# EAGLE design cc2652r_v2.1_rs (EAGLE 9.6.2)
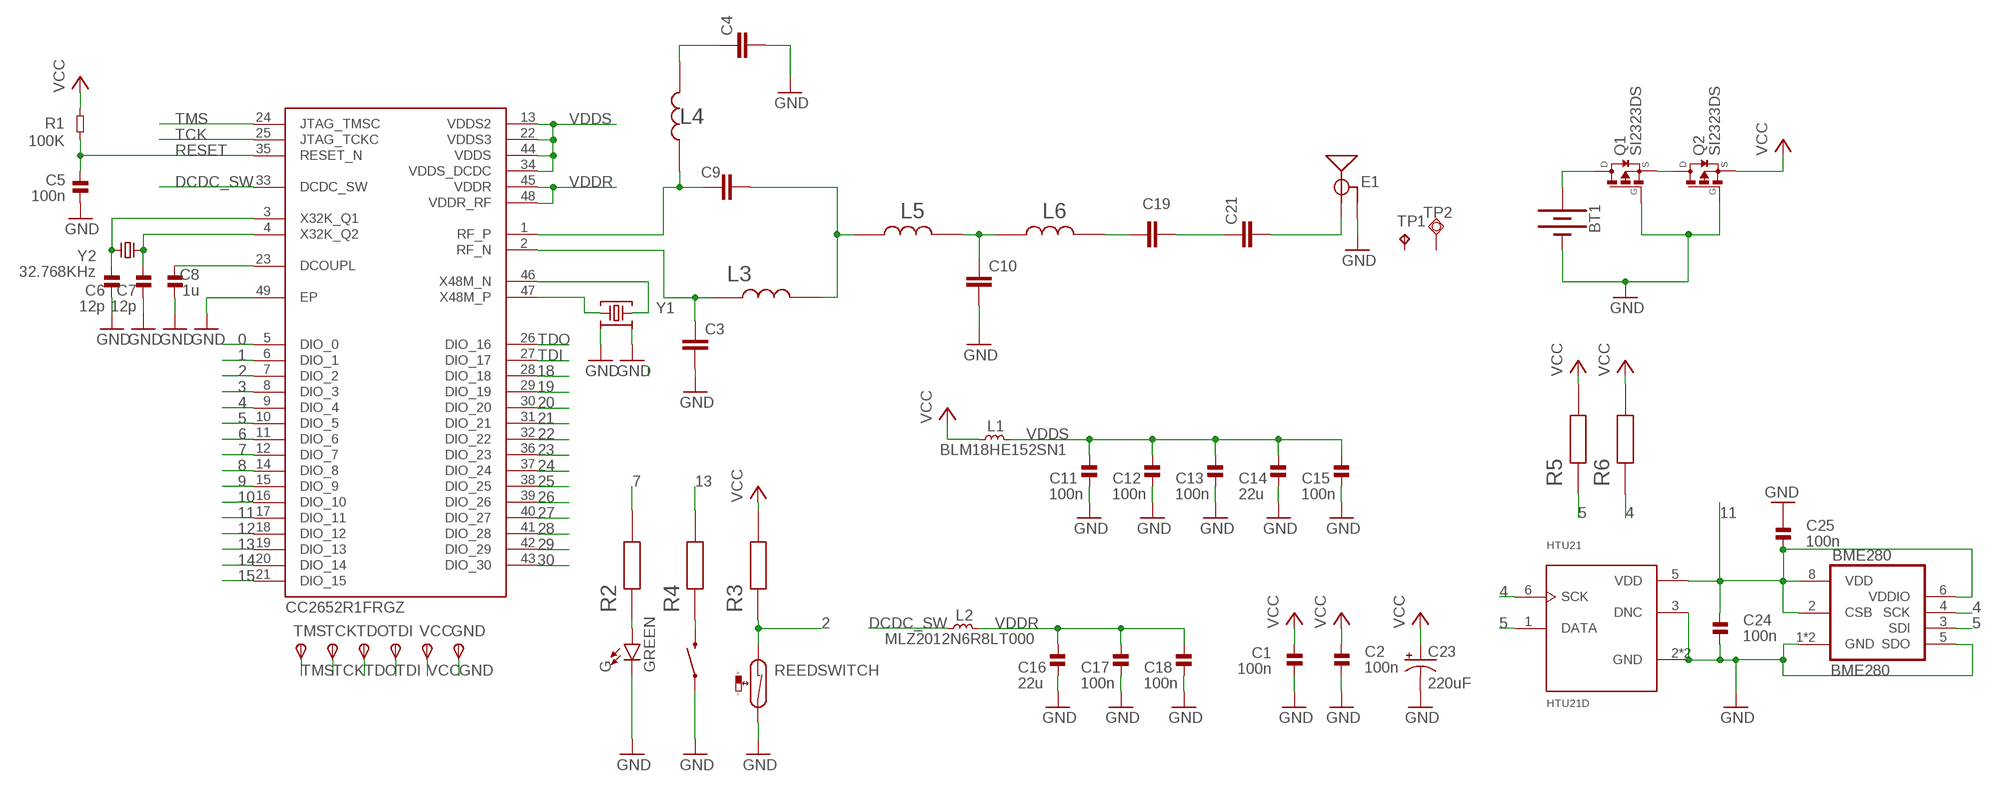
[diagram p0: schematic, sheet 1]

## Parts
BME280  BME280  [BME280]
BT1  BATTERY-20MM_SMD  [BATTCON_20MM]
C1  100n  CAP-0402  [_PKG_C_0402]
C2  100n  CAP-0402  [_PKG_C_0402]
C3  1pf  CAP0402  [CAPC1005X40N]
C4  12pF  CAP0402  [CAPC1005X40N]
C5  100n  CAP-0402  [_PKG_C_0402]
C6  12p  CAP-0402  [_PKG_C_0402]
C7  12p  CAP-0402  [_PKG_C_0402]
C8  1u  CAP-0402  [_PKG_C_0402]
C9  1pF  CAP0402  [CAPC1005X40N]
C10  1pF  CAP0402  [CAPC1005X40N]
C11  100n  CAP-0402  [_PKG_C_0402]
C12  100n  CAP-0402  [_PKG_C_0402]
C13  100n  CAP-0402  [_PKG_C_0402]
C14  22u  CAP-0805  [_PKG_C_0805]
C15  100n  CAP-0402  [_PKG_C_0402]
C16  22u  CAP-0805  [_PKG_C_0805]
C17  100n  CAP-0402  [_PKG_C_0402]
C18  100n  CAP-0402  [_PKG_C_0402]
C19  12pF  CAP0402  [CAPC1005X40N]
C21  1.8pF  CAP0402  [CAPC1005X40N]
C23  220uF  68UF-POLAR-EIA3528-10V-10%(TANT)  [EIA3528]
C24  100n  CAP-0402  [_PKG_C_0402]
C25  100n  CAP-0402  [_PKG_C_0402]
E1  ANTENNA-GROUNDEDTRACE-15.2MM  [TRACE_ANTENNA_2.4GHZ_15.2MM]
G  GREEN  LED-GREEN0603  [LED-0603]
GND  TPSTP11R  [TP11R]
HTU21  HTU21D  [QFN100P300X300X100-7N]
IC3  CC2652R1FRGZ  CC2652R1FRGZT  [QFN50P700X700X100-49N]
L1  BLM18HE152SN1  INDUCTOR-0603  [_PKG_L_0603]
L2  MLZ2012N6R8LT000  INDUCTOR-0805  [_PKG_C_0805]
L3  2.4nH  IND0402IND0402  [INDC1005X40N]
L4  2.4nH  IND0402IND0402  [INDC1005X40N]
L5  2nH  IND0402IND0402  [INDC1005X40N]
L6  2nH  IND0402IND0402  [INDC1005X40N]
Q1  SI2323DS  [SOT23]
Q2  SI2323DS  [SOT23]
R1  100K  RES-0402  [_PKG_C_0402]
R2  2.2k  RES0402  [RESC1005X40N]
R3  510k  RES0402  [RESC1005X40N]
R4  100Ohm  RES0402  [RESC1005X40N]
R5  10k  RES0402  [RESC1005X40N]
R6  10k  RES0402  [RESC1005X40N]
REEDSWITCH  REED-SWITCH-MK6-5-B  [MK6-5]
SW1  MOMENTARY-SWITCH-SPST-SMD-4.6X2.8MM  [TACTILE_SWITCH_SMD_4.6X2.8MM]
TCK  TPSTP11R  [TP11R]
TDI  TPSTP11R  [TP11R]
TDO  TPSTP11R  [TP11R]
TMS  TPSTP11R  [TP11R]
TP1  TPTP06SQ  [TP05SQ]
TP2  TPSQTP15SQ  [TP15SQ]
VCC  TPSTP11R  [TP11R]
Y1  Q22FA12800150  48.000MHZ_CX2016DB48000C0FPLC1  [XTAL-4P-2016]
Y2  32.768KHz  32.768KHZ_Q13FC1350000400  [XTAL-2P-3215]

## Nets
0: IC3.5(DIO_0)
1: IC3.6(DIO_1)
2: IC3.7(DIO_2) R3.1 REEDSWITCH.1
3: IC3.8(DIO_3)
4: BME280.4(SCK) HTU21.6(SCK) IC3.9(DIO_4) R6.1
5: BME280.3(SDI) HTU21.1(DATA) IC3.10(DIO_5) R5.1
6: IC3.11(DIO_6)
7: IC3.12(DIO_7) R2.2
8: IC3.14(DIO_8)
9: IC3.15(DIO_9)
10: IC3.16(DIO_10)
11: BME280.2(CSB) BME280.6(VDDIO) BME280.8(VDD) C24.2 C25.1 HTU21.5(VDD) IC3.17(DIO_11)
12: IC3.18(DIO_12)
13: IC3.19(DIO_13) R4.2
14: IC3.20(DIO_14)
15: IC3.21(DIO_15)
18: IC3.28(DIO_18)
19: IC3.29(DIO_19)
20: IC3.30(DIO_20)
21: IC3.31(DIO_21)
22: IC3.32(DIO_22)
23: IC3.36(DIO_23)
24: IC3.37(DIO_24)
25: IC3.38(DIO_25)
26: IC3.39(DIO_26)
27: IC3.40(DIO_27)
28: IC3.41(DIO_28)
29: IC3.42(DIO_29)
30: IC3.43(DIO_30)
DCDC_SW: IC3.33(DCDC_SW) L2.1
DCOUPL: C8.2 IC3.23(DCOUPL)
GND: BME280.1(GND) BME280.5(SDO) BME280.7(GND) BT1.2(-) C1.1 C2.1 C3.2 C4.2 C5.1 C6.1 C7.1 C8.1 C10.2 C11.2 C12.2 C13.2 C14.2 C15.2 C16.2 C17.2 C18.2 C23.C(-) C24.1 C25.2 E1.GND G.C GND.TP(PP) HTU21.2(GND) HTU21.3(DNC) HTU21.PAD(GND) IC3.49(EP) Q1.1(G) Q2.1(G) REEDSWITCH.2 SW1.1 SW1.2 Y1.2 Y1.4
N$1: C9.1 IC3.1(RF_P) L4.1
N$2: C3.1 IC3.2(RF_N) L3.1
N$3: C4.1 L4.2
N$4: C9.2 L3.2 L5.1
N$5: C19.1 L6.2
N$6: R4.1 SW1.3 SW1.4
N$7: C19.2 C21.1
N$8: BT1.1(+) Q1.3(D)
N$9: C21.2 E1.ANT(SIGNAL)
N$10: C10.1 L5.2 L6.1
N$11: G.A R2.1
N$15: Q1.2(S) Q2.3(D)
RESET: C5.2 IC3.35(RESET_N) R1.1
TCK: IC3.25(JTAG_TCKC) TCK.TP(PP)
TDI: IC3.27(DIO_17) TDI.TP(PP)
TDO: IC3.26(DIO_16) TDO.TP(PP)
TMS: IC3.24(JTAG_TMSC) TMS.TP(PP)
VCC: C1.2 C2.2 C23.A(+) L1.1 Q2.2(S) R1.2 R3.2 R5.2 R6.2 VCC.TP(PP)
VDDR: C16.1 C17.1 C18.1 IC3.45(VDDR) IC3.48(VDDR_RF) L2.2
VDDS: C11.1 C12.1 C13.1 C14.1 C15.1 IC3.13(VDDS2) IC3.22(VDDS3) IC3.34(VDDS_DCDC) IC3.44(VDDS) L1.2
X32K_Q1: C6.2 IC3.3(X32K_Q1) Y2.1
X32K_Q2: C7.2 IC3.4(X32K_Q2) Y2.2
X48M_N: IC3.46(X48M_N) Y1.3
X48M_P: IC3.47(X48M_P) Y1.1
Unconnected: TP1.TP TP2.TP

## Library data of the parts
BME280 = bosch-bme280:BME280: DIGITAL HUMIDITY, PRESSURE AND TEMPERATURE SENSOR * Digital interface I²C (up to 3.4 MHz) and SPI (3 and 4 wire, up to 10 MHz)* Supply voltage VDD main supply voltage range: 1.71 V to 3.6 V*VDDIO interface voltage range: 1.2 V to 3.6 V Operating range -40…+85 °C, 0…100 % rel. humidity, 300…1100 hPa The library has been designed by Richard Magdycz <https://www.facebook.com/groups/eaglecadsoftUK>
BT1 = Batteries:BATTERY: Battery - Single Cell A variety of battery chemistries, sizes, and footprints. Device List: 20MM_PTH - Coin Cell Battery Holder - 20mm (PTH) <https://www.sparkfun.com/products/783> 6.8MM_PTH - Coin Cell Battery Holder - 6.8MM(SMD) <https://www.digikey.com/product-detail/en/seiko-instruments/MS621FE-FL11E/728-1057-ND/1889208?WT.srch=1&gclid=CNOQ5a6LzdQCFZS2wAodXCkE0g> 12MM_SMD - Coin Cell Battery Holder - 12mm (SMD) <https://www.sparkfun.com/products/10592> 12MM_PTH - Coin Cell Battery Holder - 12mm (PTH) <https://www.sparkfun.com/products/7948> 20MM_SMD - 20mm Coin Cell Battery Holder (SMD) (2 legs) Used on the Big Time Watch Kit <https://www.sparkfun.com/products/11734> 20MM_SMD_4LEGS - Coin Cell Battery Holder - 20mm (SMD) <https://www.sparkfun.com/products/11892> 20MM_SMD_4LEGS_OVERPASTE - Coin Cell Battery Holder - 20mm (SMD) <https://www.sparkfun.com/products/11892> (Over-paste on the legs) 24.5MM_PTH - Coin Cell Battery Holder - 24.5mm (PTH) <https://www.sparkfun.com/products/8863> 9V - 9V Battery Holder - PC Mount Used on the SparkFun SparkPunk Sound Kit <https://www.sparkfun.com/products/11177> and SparkFun SparkPunk Sequencer Kit <https://www.sparkfun.com/products/12707> 18650 - Battery Holder - 18650 (PTH) <https://www.sparkfun.com/products/13113> AA - Battery Holder - 1xAA (PTH) <https://www.sparkfun.com/products/7949> AAA - Battery Holder - 1xAAA (PTH) <https://www.sparkfun.com/products/12718> AA_KIT - Battery Holder - 1xAA (PTH) <https://www.sparkfun.com/products/7949> Special kit package - pads only have exposed copper on one side of the board. AAA_KIT - Battery Holder - 1xAAA (PTH) <https://www.sparkfun.com/products/12718> Special kit package - pads only have exposed copper on one side of the board.; PROD_ID: BATT-11519
C1 C2 C5-C8 C11-C18 C24 C25 = ok-discretes-dev:CAP
C3 C4 C9 C10 C19 C21 = discretes-dev:CAP0402: CAP, 0402; AVAILABILITY: Good; DESCRIPTION: RESISTOR, 0402 0.063W 1% 3M6; Resistance:3.6Mohm; Resistance Tolerance:± 1%; Power Rating:0.063W; Voltage Rating:50V; Series:RC32H; Temperature Coefficient:± 100ppm/°C; Resistor Element Type:Thick Film; Resistor Case Style:0402; No. of Pins:2; SVHC:No SVHC; Case Style:0402; External Length / Height:1mm; Temperature Coeff. +:100ppm/°C; Temperature Coeff. -:100ppm/°C; External Depth:0.35mm; External Width:0.5mm; Operating Temperature Range:-55°C to +155°C; Overload Voltage:100V; MF: Yageo; MP: RC0402FR-073M6L; PACKAGE: 1005 Panasonic Electronic Components; PRICE: None; PURCHASE-URL: https://pricing.snapeda.com/search/part/RC0402FR-073M6L/?ref=eda
C23 = SparkFun-Capacitors:68UF-POLAR: 68µF polarized capacitors A capacitor is a passive two-terminal electrical component used to store electrical energy temporarily in an electric field.; PROD_ID: CAP-10790; VALUE: 68uF
E1 = SparkFun-RF2:ANTENNA-GROUNDED: Antenna w/ Ground Connection 2.4GHz antennae with signal and ground terminals. TRACE_ANTENNA_2.4GHZ_15.2MM - Meander Trace antenna 15.2 x 5.7mm footprint Based on layout from TI app note AN043 <http://www.ti.com/lit/an/swra117d/swra117d.pdf>. TRACE_ANTENNA_2.4GHZ_25.7MM - Inverted F trace antenna 25.7 x 7.5 mm footprint. Based on layout from TI design note DN0007 <http://www.ti.com/lit/an/swru120b/swru120b.pdf>.
G = SparkFun-LED:LED-GREEN: Green SMD LED Used in manufacturing of various products at SparkFun Packages: 0603 - SMD 0603 package [Product Link] <http://www.futureelectronics.com/en/technologies/semiconductors/optoelectronics/leds/Pages/9894312-LTST-C190GKT.aspx?CrossPart=HSMG-C190&IM=0> LilyPad 1206 - SMD1206 LilyPad package [Product Link] <http://www.futureelectronics.com/en/Technologies/Product.aspx?ProductID=IN150NGHARVATEKCORPORATION2049943&IM=0> 1206 - SMD1206 package [Product Link] <http://www.futureelectronics.com/en/technologies/semiconductors/optoelectronics/leds/Pages/8315665-LTST-C150KGKT.aspx?IM=0> 1206 Bottom Mount -SMD 1206 Bottom Mount [Product Link] <http://www.digikey.com/product-detail/en/lite-on-inc/LTST-C230KGKT/160-1456-1-ND/386854> SparkFun Products: Pro Mini 328 -5V <https://www.sparkfun.com/products/821> RedBoard <https://www.sparkfun.com/products/12757> MP3 Trigger <https://www.sparkfun.com/products/13720> Makey Makey <https://www.sparkfun.com/products/11076>; PROD_ID: DIO-00821
GND TCK TDI TDO TMS VCC = testpad:TPS: TEST PIN
HTU21 = HTU21D:HTU21D: Digital Relative Humidity sensor with Temperature output Check prices <https://pricing.snapeda.com/parts/HTU21D/TE%20Connectivity/view-part?ref=eda>; AVAILABILITY: Warning; COMMENT: CAT-HSC0004; DESCRIPTION: Humidity Temperature Sensor 0 ~ 100% RH I²C ±2% RH 5s Surface Mount; MF: TE Connectivity; MP: HTU21D; PACKAGE: DFN-6 TE Connectivity; PRICE: None; PURCHASE-URL: https://pricing.snapeda.com/search/part/HTU21D/?ref=eda
IC3 = CC2652R1FRGZT:CC2652R1FRGZT: Texas Instruments SimpleLink? Multi-Standard CC2652R Wireless MCU 48-VQFN -40 to 85 Source: Datasheet <http://www.ti.com/lit/ds/symlink/cc2652r.pdf>; ARROW_PART_NUMBER: CC2652R1FRGZT; ARROW_PRICE-STOCK: https://www.arrow.com/en/products/cc2652r1frgzt/texas-instruments; DESCRIPTION: Texas Instruments SimpleLink? Multi-Standard CC2652R Wireless MCU 48-VQFN -40 to 85; HEIGHT: 1mm; MANUFACTURER_NAME: Texas Instruments; MANUFACTURER_PART_NUMBER: CC2652R1FRGZT; MOUSER_PART_NUMBER: 595-CC2652R1FRGZT; MOUSER_PRICE-STOCK: https://www.mouser.co.uk/ProductDetail/Texas-Instruments/CC2652R1FRGZT?qs=rrS6PyfT74ekj88w7n1zLw%3D%3D
L1 L2 = ok-discretes-dev:INDUCTOR
L3-L6 = discretes-dev:IND0402: RESISTOR, 0402 0.063W 1% 3M6; Resistance:3.6Mohm; Resistance Tolerance:± 1%; Power Rating:0.063W; Voltage Rating:50V; Series:RC32H; Temperature Coefficient:± 100ppm/°C; Resistor Element Type:Thick Film; Resistor Case Style:0402; No. of Pins:2; SVHC:No SVHC; Case Style:0402; External Length / Height:1mm; Temperature Coeff. +:100ppm/°C; Temperature Coeff. -:100ppm/°C; External Depth:0.35mm; External Width:0.5mm; Operating Temperature Range:-55°C to +155°C; Overload Voltage:100V Check prices <https://pricing.snapeda.com/parts/RC0402FR-073M6L/Yageo/view-part?ref=eda>; AVAILABILITY: Good; DESCRIPTION: RESISTOR, 0402 0.063W 1% 3M6; Resistance:3.6Mohm; Resistance Tolerance:± 1%; Power Rating:0.063W; Voltage Rating:50V; Series:RC32H; Temperature Coefficient:± 100ppm/°C; Resistor Element Type:Thick Film; Resistor Case Style:0402; No. of Pins:2; SVHC:No SVHC; Case Style:0402; External Length / Height:1mm; Temperature Coeff. +:100ppm/°C; Temperature Coeff. -:100ppm/°C; External Depth:0.35mm; External Width:0.5mm; Operating Temperature Range:-55°C to +155°C; Overload Voltage:100V; MF: Yageo; MP: RC0402FR-073M6L; PACKAGE: 1005 Panasonic Electronic Components; PRICE: None; PURCHASE-URL: https://pricing.snapeda.com/search/part/RC0402FR-073M6L/?ref=eda
Q1 Q2 = SI2323DS:SI2323DS: P-Channel MOSFET; AVAILABILITY: Unavailable; DESCRIPTION: P-Channel 20V 3.7A (Ta) 750mW (Ta) Surface Mount SOT-23-3 (TO-236); MF: Vishay Siliconix; MP: SI2323DS; PACKAGE: SOT-23-3 Vishay Siliconix; PRICE: None
R1 = ok-discretes-dev:RES
R2-R6 = discretes-dev:RES0402: RESISTOR, 0402 0.063W 1% 3M6; Resistance:3.6Mohm; Resistance Tolerance:± 1%; Power Rating:0.063W; Voltage Rating:50V; Series:RC32H; Temperature Coefficient:± 100ppm/°C; Resistor Element Type:Thick Film; Resistor Case Style:0402; No. of Pins:2; SVHC:No SVHC; Case Style:0402; External Length / Height:1mm; Temperature Coeff. +:100ppm/°C; Temperature Coeff. -:100ppm/°C; External Depth:0.35mm; External Width:0.5mm; Operating Temperature Range:-55°C to +155°C; Overload Voltage:100V Check prices <https://pricing.snapeda.com/parts/RC0402FR-073M6L/Yageo/view-part?ref=eda>; AVAILABILITY: Good; DESCRIPTION: RESISTOR, 0402 0.063W 1% 3M6; Resistance:3.6Mohm; Resistance Tolerance:± 1%; Power Rating:0.063W; Voltage Rating:50V; Series:RC32H; Temperature Coefficient:± 100ppm/°C; Resistor Element Type:Thick Film; Resistor Case Style:0402; No. of Pins:2; SVHC:No SVHC; Case Style:0402; External Length / Height:1mm; Temperature Coeff. +:100ppm/°C; Temperature Coeff. -:100ppm/°C; External Depth:0.35mm; External Width:0.5mm; Operating Temperature Range:-55°C to +155°C; Overload Voltage:100V; MF: Yageo; MP: RC0402FR-073M6L; PACKAGE: 1005 Panasonic Electronic Components; PRICE: None; PURCHASE-URL: https://pricing.snapeda.com/search/part/RC0402FR-073M6L/?ref=eda
REEDSWITCH = switch-reed:REED-SWITCH-: Reed Sensor; MF: MEDER; MPN: MK6-5-B; OC_FARNELL: 1079479
SW1 = SparkFun-Switches:MOMENTARY-SWITCH-SPST: Momentary Switch (Pushbutton) - SPST Normally-open (NO) SPST momentary switches (buttons, pushbuttons). Variants PTH-12MM - 12mm square, through-hole Momentary Pushbutton Switch - 12mm Square <https://www.sparkfun.com/products/9190> (COM-09190) PTH-6.0MM, PTH-6.0MM-KIT - 6.0mm square, through-hole Mini Pushbutton Switch <https://www.sparkfun.com/products/97> (COM-00097) KIT package intended for soldering kit's - only one side of pads' copper is exposed. PTH-RIGHT-ANGLE-KIT - Right-angle, through-hole Right Angle Tactile Button <https://www.sparkfun.com/products/10791> - Used on SparkFun BigTime Watch Kit <https://www.sparkfun.com/products/11734> SMD-12MM - 12mm square, surface-mount Tactile Button - SMD (12mm) <https://www.sparkfun.com/products/12993> (COM-12993) Used on SparkFun PicoBoard <https://www.sparkfun.com/products/11888> SMD-4.5MM - 4.5mm Square Trackball Switch Used on SparkFun Blackberry Trackballer Breakout <https://www.sparkfun.com/products/13169> SMD-4.6MMX2.8MM - 4.60mm x 2.80mm, surface mount Used on SparkFun SAMD21 Mini Breakout <https://www.sparkfun.com/products/13664> SMD-5.2MM, SMD-5.2-REDUNDANT - 5.2mm square, surface-mount Mini Pushbutton Switch - SMD <https://www.sparkfun.com/products/8720> (COM-08720) Used on Arduino Pro Mini <https://www.sparkfun.com/products/11114> REDUNDANT package connects both switch circuits together SMD-6.0X3.5MM - 6.0 x 3.5mm, surface mount Momentary Reset Switch SMD <https://www.sparkfun.com/products/8229> (COM-08229) SMD-6.2MM-TALL - 6.2mm square, surface mount Tactile Button - SMD (6mm) <https://www.sparkfun.com/products/12992> Used on SparkFun Digital Sandbox <https://www.sparkfun.com/products/12651> SMD-RIGHT-ANGLE - Right-angle, surface mount Used on SparkFun Block for Intel® Edison - Arduino <https://www.sparkfun.com/products/13036>; PROD_ID: SWCH-13065
TP1 = testpad:TP: Test pad
TP2 = testpad:TPSQ: Test pad
Y1 = ok-xtal-osc-dev:48.000MHZ_CX2016DB48000C0FPLC1: 48MHz ±10ppm Crystal 7pF 50 Ohms 4-SMD, No Lead Datasheet <https://media.digikey.com/pdf/Data%20Sheets/Kyocera%20International/CX2016DB48000C0FPLC1_DS.pdf>; DIGIKEY_PART: 1253-2042-1-ND; MFG_NAME: KYOCERA; MFG_PART: CX2016DB48000C0FPLC1
Y2 = ok-xtal-osc-dev:32.768KHZ_Q13FC1350000400: SMD Crystal Resonators 32.768KHz +/-20ppm SMD-3215_2P RoHS Datasheet <https://datasheet.lcsc.com/szlcsc/1901081604_Seiko-Epson-Q13FC1350000400_C32346.pdf>; LCSC_PART: C32346; MFG_NAME: SEIKO EPSON; MFG_PART: Q13FC1350000400

## Board
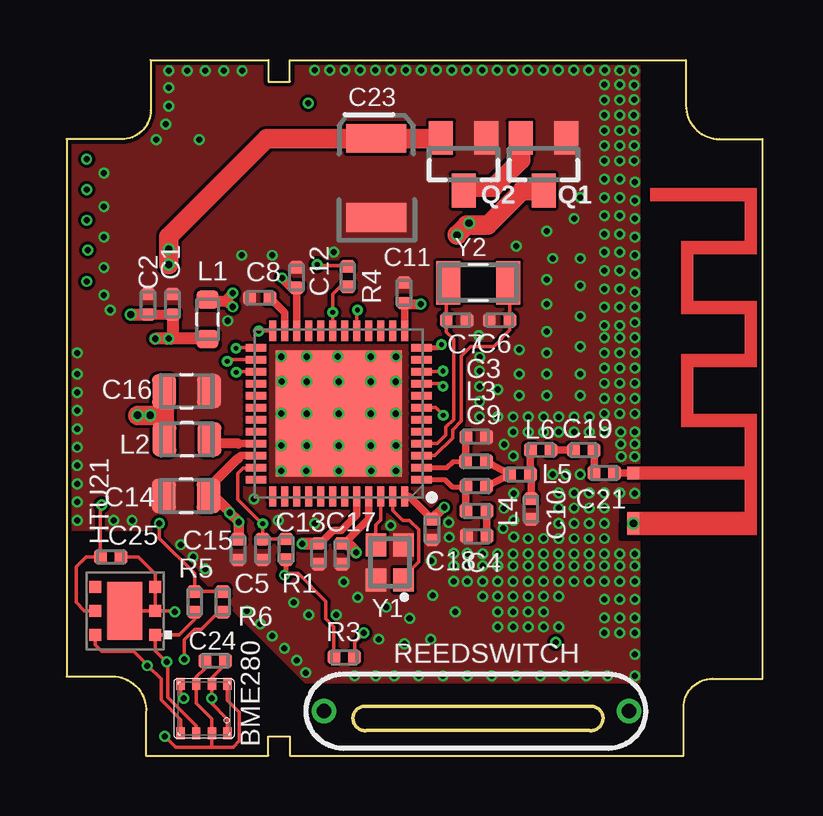
[diagram p1: board, top side]
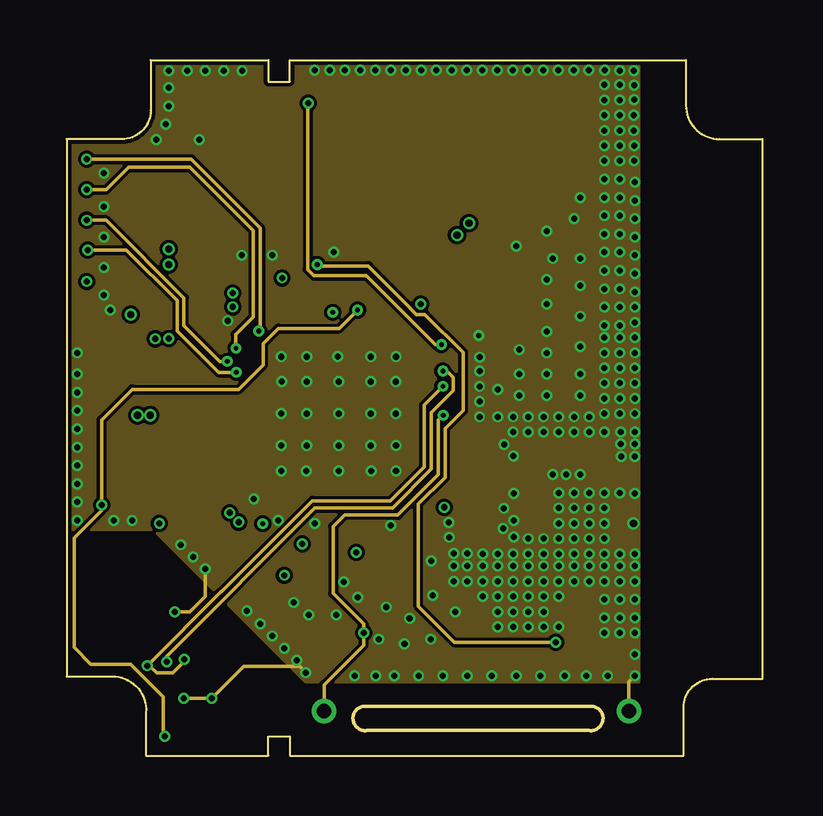
[diagram p2: board, inner layer Route2]
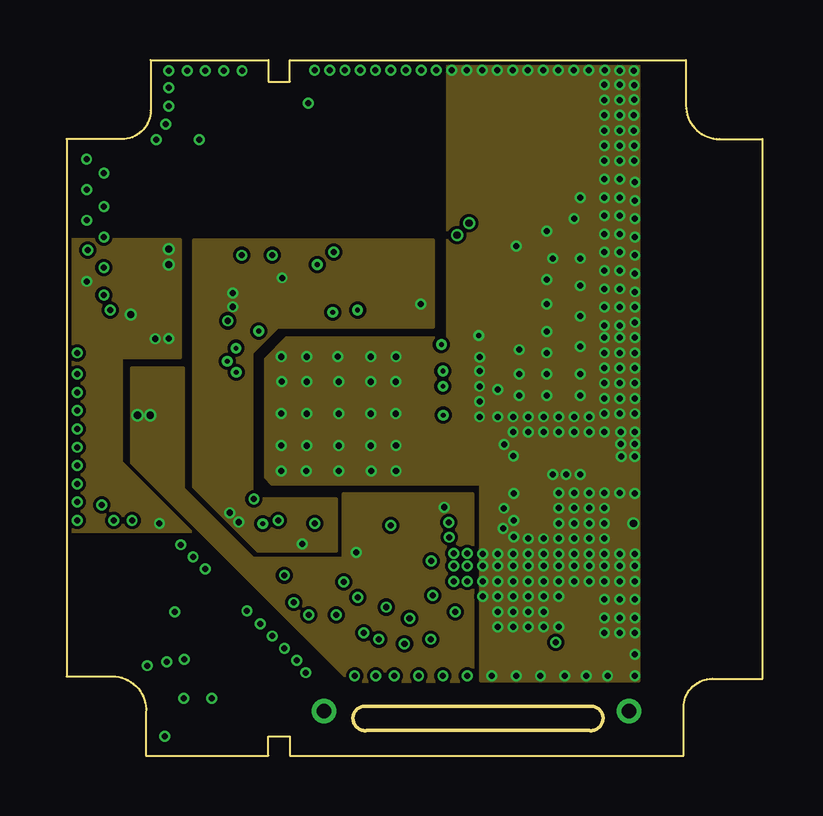
[diagram p3: board, inner layer Route15]
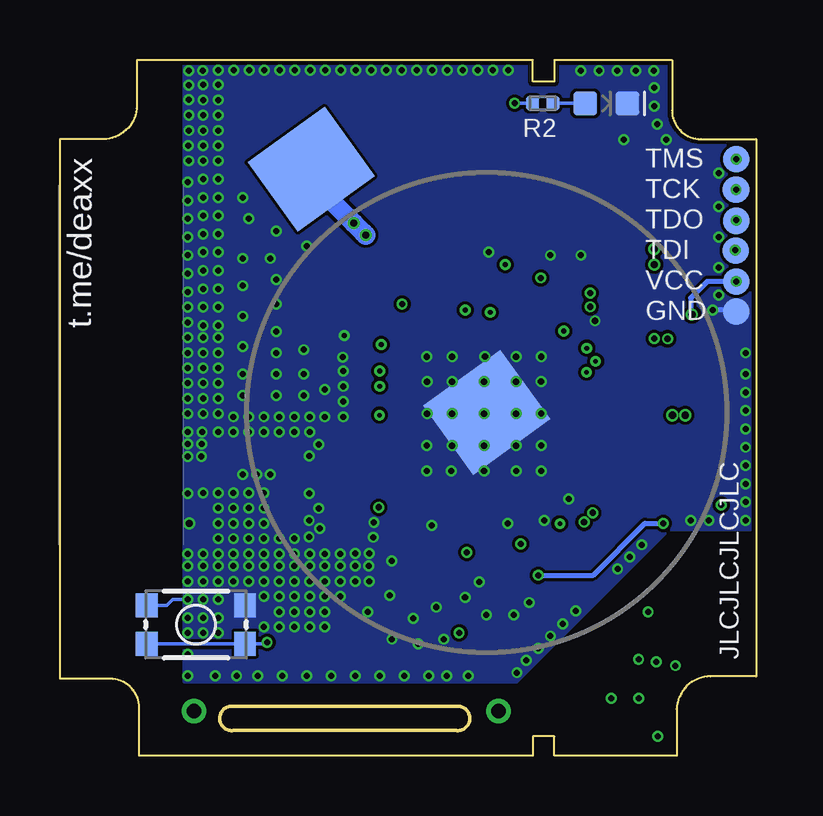
[diagram p4: board, bottom side, seen from below]

Size 29 x 29 mm. Coordinates in mm from the lower left corner, seen from the top.
Outline: 12.37,2.06 21.9,2.06 arc-180 21.77,1.04 12.5,1.04 arc-180 12.37,2.06
Outline: 29,3.2 29,25.7 27.2,25.7 arc-90 25.8,27.1 25.8,29 9.3,29 9.3,28.1 8.4,28.1 8.4,29 3.5,29 3.5,26.9 arc-90 2.3,25.7 0,25.7 0,3.3 1.9,3.3 arc-94 3.3,1.8 3.3,0 8.4,0 8.4,0.8 9.3,0.8 9.3,0 25.7,0 25.7,2 arc-90 26.9,3.2 29,3.2
Copper layers (1*2*15*16): Top 0.035559375mm / dielectric 0.17018125mm / Route2 0.01778125mm / dielectric 0.4mm / Route15 0.01778125mm / dielectric 0.17018125mm / Bottom 0.035559375mm
Design rules "oshpark-4layer *": minimum track width 6mil, minimum drill 0.2mm, track to track 5mil, track to pad 5mil, pad to pad 5mil, via to via 5mil, smd to smd 5mil, copper to edge 0.16mm, drill to drill 0.2mm, minimum pad ring 4mil, minimum via ring 4mil, stop-mask expansion 2.5mil, vias tented up to drill 50mil, thermal gap 10mil
tRestrict: area 16.4,18.8 to 17.9,20.6; 3 lines

### Footprints (pad centres in the part's own frame; a part is rotated, then mirrored left to right if it is on the bottom)
BME280 = smd 0.35 x 0.5: 1 0.975,-1.025; 2 0.325,-1.025; 3 -0.325,-1.025; 4 -0.975,-1.025; 5 -0.975,1.025; 6 -0.325,1.025; 7 0.325,1.025; 8 0.975,1.025
BATTCON_20MM = smd 3.56 x 3.96: 1 -12.5,0; 2 0,0
_PKG_C_0402 = smd 0.54 x 0.6: 1 -0.43,0; 2 0.43,0
CAPC1005X40N = smd 0.54 x 0.6: 1 -0.432,0; 2 0.432,0
_PKG_C_0805 = smd 1 x 1.42: 1 -0.935,0; 2 0.935,0
EIA3528 = smd 1.2 x 2.5: A 1.65,0; C -1.65,0
TRACE_ANTENNA_2.4GHZ_15.2MM = smd 0.5 x 0.5: ANT -3.127,-0.25 | smd 0.9 x 0.5: GND -1.027,-0.25
LED-0603 = smd 1 x 1: A -0.877,0; C 0.877,0
TP11R = smd 1.1 x 1.1: TP 0,0
QFN100P300X300X100-7N = smd 0.5 x 0.5: 1 -1.25,1; 2 -1.25,0; 3 -1.25,-1; 4 1.25,-1; 5 1.25,0; 6 1.25,1 | smd 1.45 x 2.4: PAD 0.013,0.002
QFN50P700X700X100-49N = smd 0.85 x 0.3: 1 -3.45,2.75; 2 -3.45,2.25; 3 -3.45,1.75; 4 -3.45,1.25; 5 -3.45,0.75; 6 -3.45,0.25; 7 -3.45,-0.25; 8 -3.45,-0.75; 9 -3.45,-1.25; 10 -3.45,-1.75; 11 -3.45,-2.25; 12 -3.45,-2.75; 25 3.45,-2.75; 26 3.45,-2.25; 27 3.45,-1.75; 28 3.45,-1.25; 29 3.45,-0.75; 30 3.45,-0.25; 31 3.45,0.25; 32 3.45,0.75; 33 3.45,1.25; 34 3.45,1.75; 35 3.45,2.25; 36 3.45,2.75 | smd 0.3 x 0.85: 13 -2.75,-3.45; 14 -2.25,-3.45; 15 -1.75,-3.45; 16 -1.25,-3.45; 17 -0.75,-3.45; 18 -0.25,-3.45; 19 0.25,-3.45; 20 0.75,-3.45; 21 1.25,-3.45; 22 1.75,-3.45; 23 2.25,-3.45; 24 2.75,-3.45; 37 2.75,3.45; 38 2.25,3.45; 39 1.75,3.45; 40 1.25,3.45; 41 0.75,3.45; 42 0.25,3.45; 43 -0.25,3.45; 44 -0.75,3.45; 45 -1.25,3.45; 46 -1.75,3.45; 47 -2.25,3.45; 48 -2.75,3.45 | smd 5.25 x 5.25: 49 0,0
_PKG_L_0603 = smd 0.79 x 0.93: 1 -0.82,0; 2 0.82,0
INDC1005X40N = smd 0.54 x 0.6: 1 -0.432,0; 2 0.432,0
SOT23 = smd 1 x 1.4: 1 -0.95,-1.1; 2 0.95,-1.1; 3 0,1.1
RESC1005X40N = smd 0.54 x 0.6: 1 -0.432,0; 2 0.432,0
MK6-5 = drill 0.6 pad 1.016: 1 -6.35,0; 2 6.35,0
TACTILE_SWITCH_SMD_4.6X2.8MM = smd 0.9 x 1: 1 -2.05,-0.8; 2 2.05,-0.8; 3 2.05,0.8; 4 -2.05,0.8
TP05SQ = smd 0.5 x 0.5: TP 0,0
TP15SQ = smd 0.5 x 0.9: TP 0,0
XTAL-4P-2016 = smd 0.95 x 0.85: 1 -0.725,-0.575; 2 0.725,-0.575; 3 0.725,0.575; 4 -0.725,0.575
XTAL-2P-3215 = smd 1 x 1.8: 1 -1.25,0; 2 1.25,0

### Placement (x,y rotation side)
BME280  5.72,1.96 0 top
BT1  11.22,14.31 305.8 bottom
C1  4.41,18.81 270 top
C2  3.38,18.81 270 top
C3  17.06,13.29 0 top
C4  17.08,9.15 180 top
C5  8.16,8.59 90 top
C6  18.04,18.15 0 top
C7  16.25,18.15 180 top
C8  8.04,19.08 0 top
C9  17.06,11.23 0 top
C10  19.35,10.28 270 top
C11  14.05,19.29 90 top
C12  9.58,19.93 90 top
C13  10.49,8.41 270 top
C14  4.98,10.82 180 top
C15  7.14,8.59 270 top
C16  4.99,15.19 0 top
C17  11.46,8.41 270 top
C18  15.22,9.43 270 top
C19  21.54,12.73 359.8 top
C21  22.4,11.77 359.8 top
C23  12.9,24.08 90 top
C24  6.19,3.95 180 top
C25  1.83,8.28 0 top
E1  23.85,8.65 270 top
G  6.24,27.19 0 bottom
GND  0.82,18.5 0 bottom
HTU21  2.44,6.03 180 top
IC3  11.33,14.25 180 top
L1  5.87,18.19 90 top
L2  5.01,13.18 180 top
L3  17.05,12.26 0 top
L4  17.07,10.19 0 top
L5  18.89,11.71 0 top
L6  19.75,12.73 359.4 top
Q1  19.87,24.65 180 top
Q2  16.54,24.65 180 top
R1  9.13,8.6 270 top
R2  8.89,27.2 180 bottom
R3  11.56,4.1 180 top
R4  11.71,19.97 270 top
R5  5.32,6.4 90 top
R6  6.49,6.4 90 top
REEDSWITCH  17.07,1.85 0 top
SW1  23.34,5.46 180 bottom
TCK  0.83,23.59 0 bottom
TDI  0.84,21.05 0 bottom
TDO  0.82,22.29 0 bottom
TMS  0.82,24.86 0 bottom
TP1  23.6,11.77 0 top
TP2  23.61,9.67 0 top
VCC  0.82,19.77 0 bottom
Y1  13.46,8.05 90 top
Y2  17.15,19.71 180 top

### Tracks (layer width: path | path; a pad name or v marks a point on that pad's centre or on a via)
2  (via drill 0.2 pad 0.45, 0.25)
  Top 0.152: IC3.7 15.38,14.5 v15.69,14.19 | R3.1 11.99,4.73 v12.37,5.11
  Route2 0.152: v15.69,14.19 15.48,13.98 15.48,11.71 13.8,10.03 11.58,10.03 11.1,9.55 11.1,6.76 12.37,5.49 v12.37,5.11 12.37,4.6 10.72,2.95 REEDSWITCH.1
4  (via drill 0.2 pad 0.45, 0.25)
  Top 0.152: BME280.4 4.75,1.5 3.93,2.31 3.93,3.2 3.39,3.75 v3.36,3.75 3.36,3.78 2.8,4.35 1.45,4.35 1.19,4.6 HTU21.6 | IC3.9 15.57,15.5 v15.68,15.39 | R6.1 6.31,5.97 5.6,5.26 5.34,5.26 4.9,4.82 v4.9,4.01
  Route2 0.152: v15.68,15.39 14.9,14.61 14.9,12.04 13.48,10.62 10.24,10.62 6.46,6.84 6.44,6.84 v3.36,3.75 3.44,3.75 3.74,3.45 4.42,3.45 4.9,3.92 v4.9,4.01
5  (via drill 0.2 pad 0.45, 0.25)
  Top 0.152: BME280.3 5.4,1.24 4.21,2.43 4.21,3.85 v4.16,3.9 4.15,3.9 3.69,4.36 HTU21.1 4.68,5.03 5.32,5.68 R5.1 | IC3.10 15.65,16 v15.68,16.03
  Route2 0.152: v4.16,3.9 4.16,4.15 10.34,10.33 13.58,10.33 15.19,11.94 15.19,14.3 16.11,15.22 16.11,15.76 15.84,16.03 v15.68,16.03
7  (via drill 0.2 pad 0.45, 0.25)
  Top 0.2: IC3.12 15.48,17 v15.61,17.13
  Route2 0.152: v10.06,27.2 10.04,27.18 10.04,20.27 10.3,20.01 12.48,20.01 15.36,17.13 v15.61,17.13
  Bottom 0.152: v10.06,27.2 R2.2
11  (via drill 0.2 pad 0.45, 0.25)
  Top 0.152: 6.71,3 BME280.8 6.7,2.31 7.19,1.81 7.19,0.61 6.94,0.35 6.05,0.35 | HTU21.5 0.74,6.03 0.39,6.38 0.39,7.86 0.82,8.28 C25.1 1.4,10.44 v1.45,10.44 | C24.2 5.77,3.64 5.4,3.27 BME280.6 5.4,2.18 6.05,1.53 BME280.2 6.05,0.35 | v4.09,0.81 4.54,0.35 6.05,0.35 | IC3.17 12.08,18.53 v12.12,18.57
  Route2 0.152: v4.09,0.81 4.02,0.88 4.02,2.44 2.66,3.8 1.01,3.8 0.31,4.5 0.31,9.07 1.45,10.21 v1.45,10.44 1.45,14 2.72,15.27 7.17,15.27 8.18,16.28 8.18,17.17 8.82,17.81 11.36,17.81 v12.12,18.57
13  (via drill 0.2 pad 0.45)
  Top 0.152: IC3.19 v11.08,18.48 | v11.08,18.48 | v11.08,18.48 11.08,19.24 11.37,19.53 R4.2
24
  Top 0.152: IC3.37 8.48,10.7
DCDC_SW
  Top 0.305: IC3.33 7.17,13
  Top 0.406: 7.17,13 6.12,13 L2.1
DCOUPL
  Top 0.305: IC3.23 9.08,18.47 C8.2
GND  (via drill 0.2 pad 0.45, 0.25, 0.25 pad 0.46, 0.3)
  Top 0.152: BME280.1 6.7,1.52 6.04,2.18 v6.04,2.38 BME280.7 6.06,3 6.06,3.27 6.65,3.85 6.65,3.92 C24.1 | 2.45,6.03 HTU21.PAD HTU21.2 | v4.88,2.38 4.75,2.52 BME280.5 | HTU21.2 4.46,6.03 v4.5,6 | HTU21.2 HTU21.3 3.69,7.57 2.97,8.28 C25.2
  Top 0.2: v23.61,9.68 E1.GND
  Route2 0.152: v5.77,7.77 5.77,6.63 5.13,6 v4.5,6 | v9.96,3.46 9.7,3.71 7.37,3.71 v6.04,2.38 v4.88,2.38 | REEDSWITCH.2 23.42,3.07 v23.68,3.33
  Bottom 0.152: SW1.2 24.55,6.26 24.31,6.5 v23.68,6.5
  Bottom 0.2: GND.TP 0.88,18.57 v1.8,18.57
  other vias: 12.67,15.58 11.33,14.25 10,15.58 11.33,15.58 12.67,14.25 12.67,12.92 11.33,12.92 10,12.92 10,14.25 17.16,17.51 6.71,18.12 15.18,8.12 11.13,20.98 10,16.63 11.29,16.64 12.67,16.63 9.99,11.86 11.33,11.86 12.69,11.86 8.94,16.63 8.96,15.6 8.94,14.26 8.94,12.93 8.94,11.86 13.72,11.86 13.72,12.93 13.71,14.25 13.71,15.58 13.72,16.63 23.64,27.95 23.68,19.33 23.68,18.7 23.68,18.06 23.68,17.43 23.68,16.79 23.68,16.16 23.68,15.52 23.68,14.89 23.68,14.25 23.68,7.9 23.68,7.27 23.04,7.27 22.41,7.27 21.77,7.27 21.14,7.27 20.5,7.27 19.87,7.27 23.68,20.09 23.63,28.56 23.64,27.34 23.63,26.7 23.63,26.06 23.65,25.43 23.64,24.79 23.05,28.56 22.41,28.57 21.75,28.57 17.96,7.27 17.33,7.27 17.33,7.9 16.69,7.9 16.69,8.42 18.6,7.27 19.23,7.27 23.04,24.79 21.12,28.57 20.48,28.57 19.85,28.57 19.21,28.57 18.58,28.57 17.94,28.57 17.31,28.57 16.67,28.57 16.04,28.57 15.4,28.57 14.77,28.57 14.13,28.57 13.5,28.57 12.86,28.57 12.23,28.57 11.59,28.57 10.96,28.57 10.32,28.57 7.3,28.55 6.54,28.55 5.78,28.55 5.02,28.55 4.25,28.55 4.25,27.84 4.25,27.08 4.12,26.32 3.74,25.68 9.58,3.96 9.07,4.47 8.56,4.98 8.06,5.49 5.26,8.28 4.75,8.79 0.43,9.81 1.96,9.81 2.72,9.81 0.43,10.57 0.43,11.33 0.43,12.09 0.43,12.85 0.43,13.62 0.43,14.38 0.43,15.14 0.43,15.9 0.43,16.79 22.53,3.33 21.64,3.33 20.75,3.33 19.74,3.33 18.72,3.33 17.71,3.33 16.69,3.33 15.68,3.33 14.66,3.33 13.64,3.33 12.88,3.33 7.51,6.03 23.04,27.97 23.04,27.33 23.04,26.7 23.04,26.06 23.04,25.43 23.68,5.74 23.68,5.11 23.04,5.74 23.04,5.11 22.41,5.74 22.41,5.11 23.68,4.22 17.33,6.63 17.96,6.63 18.6,6.63 19.23,6.63 19.87,6.63 16.69,7.27 22.41,6.5 23.04,6.5 20.5,6.63 13.01,4.85 1.55,24.28 1.55,22.89 1.55,21.62 1.55,20.35 1.55,19.2 11.23,5.87 10.09,5.87 7.29,20.85 8.56,20.85 15.26,6.68 11.99,3.33 23.04,14.25 23.04,14.89 23.04,15.52 23.04,16.16 23.04,16.79 23.04,17.43 7.8,10.7 8.82,9.81 10.34,9.68 17.96,6 17.96,5.36 18.6,6 19.23,6 19.87,6 18.6,5.36 19.23,5.36 19.87,5.36 20.5,5.36 23.68,20.85 23.68,21.62 23.68,22.38 23.68,23.14 23.68,23.9 23.04,24.03 23.04,23.27 23.04,22.51 23.04,21.74 23.04,20.98 23.04,20.22 23.04,19.46 23.04,18.7 23.04,17.93 23.68,8.41 23.68,13.49 23.67,12.47 23.08,13.48 23.11,12.47 23.67,10.93 23.09,12.99 23.68,13 17.96,7.9 18.6,7.9 19.23,7.9 19.87,7.9 20.5,7.9 21.14,7.9 21.77,7.9 22.41,7.9 23.04,7.9 17.33,8.41 17.96,8.41 18.6,8.41 19.23,8.41 19.87,8.41 20.5,8.41 21.14,8.41 21.77,8.41 22.41,8.41 23.04,8.41 22.41,27.97 22.41,27.33 22.41,26.7 22.41,26.06 22.41,25.43 22.41,24.79 22.41,24.03 22.41,23.27 22.41,22.51 22.41,21.74 22.41,20.98 22.41,20.22 22.41,19.46 22.41,18.7 22.41,17.93 22.41,17.43 22.41,16.79 22.41,16.16 22.41,15.52 22.41,14.89 22.41,14.25 22.41,13.49 18.62,9.11 19.23,9.04 19.87,9.04 20.5,9.04 20.5,9.68 20.5,10.31 20.5,10.95 20.25,11.71 21.39,11.71 21.14,10.95 21.14,10.31 21.14,9.68 21.14,9.04 21.77,9.04 21.77,9.68 21.77,10.31 21.77,10.95 22.41,10.95 23.04,10.95 21.77,13.49 21.14,13.49 20.5,13.49 19.87,13.49 19.23,13.49 18.6,13.49 18.6,14.12 17.96,14.12 17.2,14.12 17.2,14.76 17.2,15.39 17.2,16.03 17.21,16.61 22.41,9.04 22.41,9.68 22.41,10.31 18.61,12.49 18.62,10.92 18.62,9.8 19.23,14.12 19.87,14.12 20.5,14.12 21.14,14.12 21.77,14.12 19.99,18.82 18.85,15.9 21.39,15.01 21.39,17.04 19.99,16.79 20.25,20.73 21.14,22.38 21.39,19.58 19.99,19.84 19.99,17.68 17.96,15.27 19.99,15.01 21.39,15.9 18.72,21.24 21.39,20.73 5.51,25.68 19.99,21.87 21.39,18.31 19.99,15.9 18.85,15.01 18.85,16.92 21.39,23.27 20.8,11.71 16.12,8.42 16.13,7.9 16.12,7.27 18.18,9.48 18.22,10.31 18.22,12.96 15.94,9.1 15.92,9.72 13.5,9.59 11.54,7.24 13.32,6.19 14.07,4.66 12.12,6.6 9.45,6.38 15.17,4.85 16.18,6 14.28,5.71
  pour Route15: 8.28,16.54 8.28,11.58 8.54,11.33 17.25,11.33 17.25,3.11 23.83,3.11 23.83,29.38 15.87,29.38 15.87,17.4 9.15,17.4
  pour Top (no thermals): -0.33,9.43 3.61,9.43 9.96,3.07 23.83,3.07 23.83,29.29 -0.33,29.29
  pour Bottom (no thermals): -0.45,9.43 -0.45,29.36 23.83,29.36 23.83,3.07 9.96,3.07 3.61,9.43
  pour Route2: -0.33,29.24 23.84,29.24 23.84,3.07 9.96,3.07 3.61,9.43 -0.33,9.43
N$1
  Top 0.203: IC3.1 15.76,11.5 16.06,11.2 16.6,11.2 C9.1
  Top 0.305: C9.1 16.63,10.21 L4.1
N$2
  Top 0.203: IC3.2 15.84,12 16.1,12.26 L3.1
  Top 0.305: L3.1 C3.1
N$3
  Top 0.305: L4.2 17.51,9.16 C4.1
N$4
  Top 0.305: 17.49,12.25 L3.2 L5.1 C9.2
N$5
  Top 0.305: L6.2 C19.1
N$6  (via drill 0.2 pad 0.45, 0.25)
  Top 0.152: R4.1 11.69,20.42 10.49,20.42 v10.44,20.47
  Route2 0.152: v10.44,20.47 10.44,20.41 12.57,20.41 14.32,18.66 14.32,18.64 14.57,18.39 14.93,18.39 16.51,16.81 16.51,14.38 15.76,13.63 15.76,11.59 14.65,10.48 14.65,6.22 16.14,4.73 v20.37,4.73
  Bottom 0.152: SW1.3 SW1.4 20.44,4.66 v20.37,4.73
N$7
  Top 0.305: C19.2 C21.1
N$8  (via drill 0.3)
  Top 0.813: Q1.3 18.98,23.55 17.55,22.12 16.66,22.12 16.26,21.72 v16.26,21.7
  Bottom 0.813: 16.36,21.8 v16.26,21.7 v16.76,22.2 18,23.43 18.54,24.09 BT1.1 18.29,24.14
N$9
  Top 0.305: C21.2 | C21.2 23.06,11.77 23.07,11.78 | E1.ANT C21.2
N$10
  Top 0.305: L5.2 19.33,11.7 L5.2 | L5.2 19.28,11.75 | C10.1 19.35,11.68 L5.2 | L5.2 L6.1
N$11
  Bottom 0.152: G.A 8.45,27.19 R2.1
N$15
  Top 0.813: Q2.3 16.68,23.7 17.8,23.7 18.92,24.82 Q1.2
RESET  (via drill 0.2 pad 0.45)
  Top 0.152: R1.1 C5.2 8.16,9.63 8.17,9.64 v8.17,9.67 8.14,9.67 7.13,10.68 7.13,11.76 7.35,11.98 7.86,11.98 IC3.35
TCK  (via drill 0.2 pad 0.45, 0.25)
  Top 0.152: IC3.25 7.07,17 v7.05,16.98
  Route2 0.152: v7.05,16.98 7.04,16.99 7.04,17.55 7.78,18.29 7.78,21.88 5.13,24.52 2.58,24.52 1.66,23.6 v0.83,23.6
  Bottom 0.2: v0.83,23.6 TCK.TP
TDI  (via drill 0.2 pad 0.45, 0.25)
  Top 0.152: IC3.27 7.09,16 v7.06,15.98
  Route2 0.152: v0.87,21.08 2.48,21.08 4.6,18.96 4.6,17.7 6.33,15.98 v7.06,15.98
  Bottom 0.152: 0.83,21.05 TDI.TP
  Bottom 0.2: v0.87,21.08 TDI.TP
TDO  (via drill 0.2 pad 0.45, 0.25)
  Top 0.152: IC3.26 7.87,16.51 6.76,16.51 v6.68,16.43
  Route2 0.152: v6.68,16.43 6.38,16.43 4.88,17.93 4.88,19.08 1.64,22.31 v0.83,22.31
  Bottom 0.152: 0.88,22.29 TDO.TP
  Bottom 0.2: v0.83,22.31 v0.82,22.3 TDO.TP
TMS  (via drill 0.2 pad 0.45, 0.25)
  Top 0.152: IC3.24 8.01,17.7 v8,17.69
  Route2 0.152: TMS.TP 5.19,24.86 8.06,22 8.06,17.74 v8,17.69
  Bottom 0.2: TMS.TP
  other vias: 0.82,24.86
VCC  (via drill 0.25, 0.25 pad 0.46, 0.3)
  Top 0.152: R6.2 R5.2 5.32,7.58 3.86,9.04 v3.86,9.68 | 11.1,4.13 R3.2 11.13,5.36 10.8,5.69 10.8,6.43 9.64,7.58 9.14,7.58
  Top 0.203: R1.2 9.14,7.58 v9.07,7.52
  Top 0.406: C2.2 C1.2 | 4.41,17.45 4.33,17.38 | v4.25,17.39 4.18,17.39 4.17,17.38
  Top 0.508: L1.1 5.84,17.39 v4.25,17.39 | 4.33,17.38 4.17,17.38 v3.69,17.38 | C1.2 4.41,17.45 | C2.2 3.37,18.37 2.69,18.37 v2.67,18.39
  Top 0.813: v4.25,20.47 v4.25,21.11 | v4.25,21.11 4.25,21.45 | v4.25,21.11 4.25,21.64 8.33,25.73 C23.A 15.56,25.73 Q2.2 15.54,25.8
  Route2 0.152: v9.07,7.52 9.05,7.54
  Bottom 0.2: VCC.TP 2.03,19.77 2.72,19.08 2.72,18.44 v2.67,18.39
  Bottom 0.203: v9.07,7.52 6.79,7.52 4.63,9.68 v3.86,9.68
  other vias: 0.83,19.77
  pour Route15: 4.73,21.5 4.73,16.6 2.28,16.6 2.28,12.23 5.16,9.35 0.12,9.35 0.12,21.5
VDDR  (via drill 0.25, 0.25 pad 0.46, 0.3)
  Top 0.305: IC3.45 12.58,9.86 11.56,8.84 C17.1 11.68,8.84 | IC3.48 14.27,10.8 C18.1
  Top 0.406: C18.1 v15.71,10.35 v15.72,10.35
  Top 0.508: 11.68,8.84 v12.06,8.46
  Top 0.813: C16.1 4.07,15.18 4.07,14.19 | L2.2 4.07,14.19 | 4.07,14.19 v2.95,14.19
  other vias: 3.48,14.19
  pour Route15: 11.52,10.91 11.52,8.22 7.78,8.22 4.85,11.14 4.85,16.16 2.71,16.16 2.71,12.21 11.81,3.1 16.92,3.1 16.92,10.91
VDDS  (via drill 0.25, 0.25 pad 0.45, 0.25 pad 0.46)
  Top 0.152: 6.02,18.86 L1.2
  Top 0.305: L1.2 6.64,19.01 | IC3.34 7.25,12.5 7.13,12.38 | C14.1 6.13,10.82 | 7.17,9.04 C15.1 | IC3.44 12.08,10.02 11.45,9.39 11.11,9.39 10.56,8.84 C13.1 | v9.81,8.83 v9.82,8.84 | IC3.13 14.08,18.83 C11.1 | IC3.22 C12.1
  Top 0.33: 6.76,18.86 6.02,18.86
  Top 0.406: v6.91,19.28 6.64,19.01 | v6.91,18.71 6.76,18.86 | C11.1 14.09,18.82 v14.75,18.82 | C12.1 9.4,19.5 8.98,19.91 v8.97,19.91 | C14.1 5.92,11.17 7.13,12.38
  Top 0.432: 6.13,10.82 6.8,10.16 v6.8,10.12 7.17,9.76 v7.17,9.73 7.17,9.04
  Top 0.508: v9.82,8.84 C13.1
  pour Route15: 11.23,8.54 7.97,8.54 5.3,11.2 5.3,21.49 15.28,21.49 15.28,17.87 8.79,17.87 7.71,16.79 7.71,10.7 11.23,10.7
X32K_Q1
  Top 0.152: 15.08,12.5 IC3.3 15.34,12.5 16.08,13.25 16.08,13.58 16.44,13.94 16.44,16.65 16.84,17.06 17.78,17.06 18.47,17.74 C6.2 18.47,19.64 Y2.1
X32K_Q2
  Top 0.152: 14.79,13.01 IC3.4 15.44,13 15.8,13.36 15.8,13.7 16.12,14.01 16.12,16.79 16.12,16.85 16.12,17.36 15.82,17.66 C7.2 | C7.2 | C7.2 15.82,18.19 15.82,19.63 Y2.2
X48M_N
  Top 0.152: 13.06,10.78 IC3.46 13.08,9.82 12.87,9.61 12.87,8.79 Y1.3
X48M_P
  Top 0.152: 13.59,10.79 IC3.47 13.58,10.22 13.99,9.81 14.28,9.81 14.67,9.42 14.67,8.08 14.04,7.45 Y1.1

### Text on the board
tNames: .
bNames: TMS | TCK | TDO | TDI | VCC | GND | t.me/deaxx | JLCJLCJLCJLC